# EAGLE design EEPROM SMD Breakout Jumper (EAGLE 8.4.0)
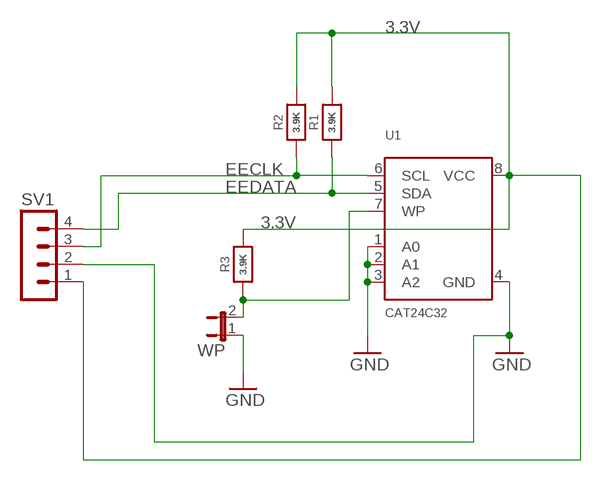
[diagram p0: schematic, sheet 1]

## Parts
R1  3.9K  RESISTOR0805_NOOUTLINE  [0805-NO]
R2  3.9K  RESISTOR0805_NOOUTLINE  [0805-NO]
R3  3.9K  RESISTOR0805_NOOUTLINE  [0805-NO]
SV1  MA04-1  [MA04-1]
U1  CAT24C32  EEPROM_I2C_SOIC8_GENERIC  [SOIC8_150MIL]
WP  JP1E  [JP1]

## Nets
3.3V: R1.2 R2.2 R3.2 SV1.1 U1.8(VCC)
EECLK: R2.1 SV1.3 U1.6(SCL)
EEDATA: R1.1 SV1.4 U1.5(SDA)
GND: SV1.2 U1.1(A0) U1.2(A1) U1.3(A2) U1.4(GND) WP.1
N$16: R3.1 U1.7(WP) WP.2

## Library data of the parts
R1-R3 = microbuilder:RESISTOR: Resistors For new designs, use the packages preceded by an '_' character since they are more reliable: The following footprints should be used on most boards: _0402 - Standard footprint for regular board layouts _0603 - Standard footprint for regular board layouts _0805 - Standard footprint for regular board layouts _1206 - Standard footprint for regular board layouts For extremely tight-pitch boards where space is at a premium, the following 'micro-pitch' footprints can be used (smaller pads, no silkscreen outline, etc.): _0402MP - Micro-pitch footprint for very dense/compact boards _0603MP - Micro-pitch footprint for very dense/compact boards _0805MP - Micro-pitch footprint for very dense/compact boards _1206MP - Micro-pitch footprint for very dense/compact boards
SV1 = con-lstb:MA04-1: PIN HEADER; OC_FARNELL: unknown; OC_NEWARK: unknown
U1 = microbuilder:EEPROM_I2C_SOIC8_GENERIC: Note: The same pinout is used for many I2C EEPROMs in SOIC8(150mil) from a variety of manufacturers and in various sizes. Examples: 16K (2K x 8 Bit) I2C EEPROM 1.7-5.5V, 400KHz, -40°C-85°C Digikey: CAT24C16WI-GT3CT-ND 256K (32K x 8 Bit) I2C EEPROM 1.7-5.5V, 400KHz, -40°C-85°C Digikey: 24AA256-I/SN-ND
WP = jumper:JP1E: JUMPER

## Board
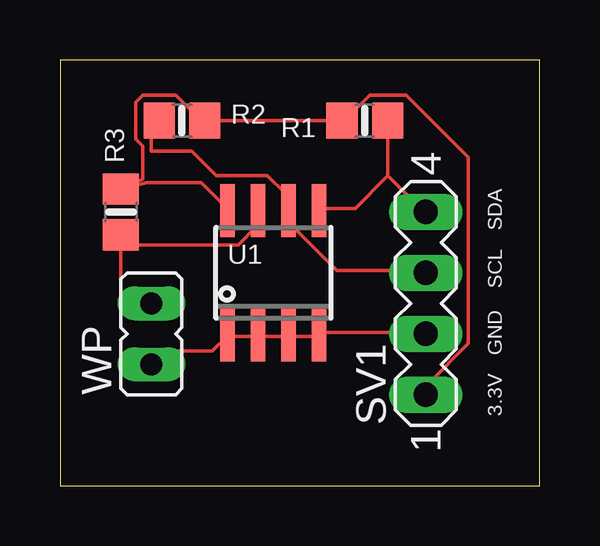
[diagram p1: board, top side]

Size 19.99 x 17.77 mm. Coordinates in mm from the lower left corner, seen from the top.
Outline: 0,0 19.99,0 19.99,17.77 0,17.77 0,0
Copper layers (1*16): Top 0.035mm / dielectric 1.5mm / Bottom 0.035mm
Design rules "default": minimum track width 6mil, minimum drill 0.35mm, track to track 6mil, track to pad 6mil, pad to pad 6mil, via to via 6mil, smd to smd 6mil, copper to edge 40mil, drill to drill 6mil, minimum pad ring 10mil, minimum via ring 8mil, stop-mask expansion 4mil, vias tented up to drill 0mil, thermal gap 10mil

### Footprints (pad centres in the part's own frame; a part is rotated, then mirrored left to right if it is on the bottom)
0805-NO = smd 1.3 x 1.5: 1 -0.95,0; 2 0.95,0
MA04-1 = drill 1.016 long: 1 -3.81,0; 2 -1.27,0; 3 1.27,0; 4 3.81,0
SOIC8_150MIL = smd 0.6 x 2.2: 1 -1.905,-2.6; 2 -0.635,-2.6; 3 0.635,-2.6; 4 1.905,-2.6; 5 1.905,2.6; 6 0.635,2.6; 7 -0.635,2.6; 8 -1.905,2.6
JP1 = drill 0.914 long: 1 0,-1.27; 2 0,1.27

### Placement (x,y rotation side)
R1  12.7,15.24 180 top
R2  5.08,15.24 0 top
R3  2.54,11.43 90 top
SV1  15.24,7.62 90 top
U1  8.89,8.89 0 top
WP  3.81,6.35 0 top

### Tracks (layer width: path | path; a pad name or v marks a point on that pad's centre or on a via)
3.3V
  Top 0.152: U1.8 6.96,11.58 5.89,12.65 3.61,12.65 R3.2 3.45,12.8 3.45,14.17 3.15,14.48 3.15,16 3.45,16.31 4.83,16.31 5.89,15.24 R2.2 R1.2 11.84,15.24 12.9,16.31 14.43,16.31 17.02,13.72 17.02,5.94 15.34,4.27 15.34,3.81 SV1.1
EECLK
  Top 0.152: 4.22,15.24 R2.1 3.81,14.92 3.81,13.97 5.49,13.97 6.5,12.95 8.64,12.95 9.4,12.19 9.4,11.58 U1.6 9.55,11.43 9.55,10.97 11.53,8.99 15.19,8.99 SV1.3
EEDATA
  Top 0.152: 13.66,12.95 13.66,15.24 R1.1 | 13.66,12.95 15.19,11.43 SV1.4 | 13.66,12.95 12.29,11.58 10.92,11.58 U1.5
GND
  Top 0.152: SV1.2 15.19,6.4 10.92,6.4 U1.4 10.77,6.25 9.55,6.25 U1.3 9.4,6.25 8.33,6.25 U1.2 8.18,6.25 7.11,6.25 U1.1 6.96,6.25 6.35,5.64 4.37,5.64 WP.1
N$16
  Top 0.152: 2.54,8.38 2.54,8.89 | 2.54,8.89 2.54,10.06 | 2.54,10.06 R3.1 2.54,10.36 | 2.54,10.06 7.42,10.06 8.18,10.82 8.18,11.43 U1.7 | 2.54,8.89 2.54,7.62 WP.2

### Text on the board
tPlace: SDA | SCL | GND | 3.3V